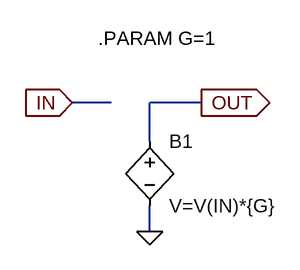
[diagram p0: schematic Gain.asc]
Gain.asc, the LTspice schematic file:
Version 4
SHEET 1 1188 680
WIRE 304 224 256 224
WIRE 416 224 352 224
WIRE 352 272 352 224
WIRE 352 384 352 352
FLAG 256 224 IN
IOPIN 256 224 In
FLAG 416 224 OUT
IOPIN 416 224 Out
FLAG 352 384 0
SYMBOL bv 352 256 R0
SYMATTR InstName B1
SYMATTR Value V=V(IN)*{G}
TEXT 288 144 Left 0 !.PARAM G=1

The netlist it stands for:
* Gain.asc
B1 OUT 0 V=V(IN)*{G}
.PARAM G=1
.backanno
.end